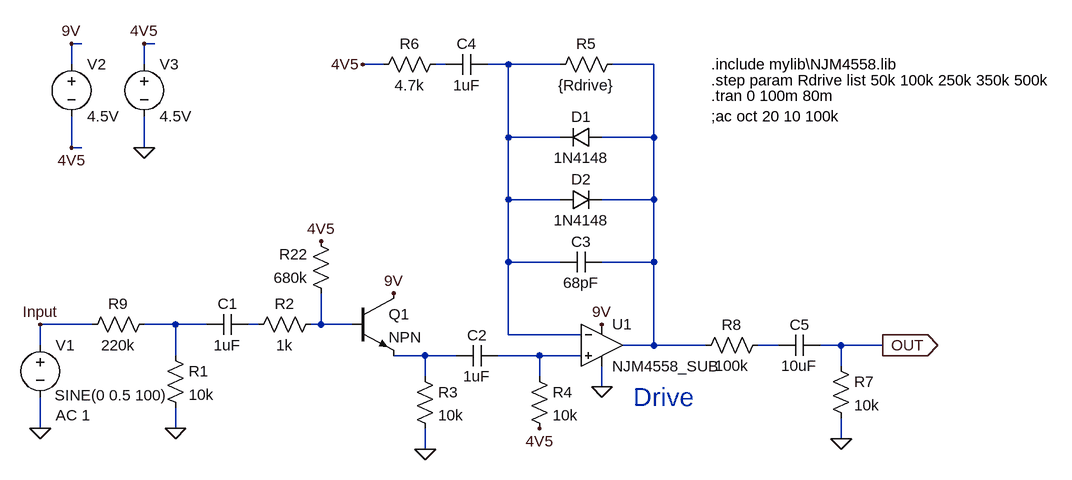
[diagram p0: schematic Tube_Screamer_Drive.asc]
Tube_Screamer_Drive.asc, the LTspice schematic file:
Version 4
SHEET 1 2708 1284
WIRE 176 -320 160 -320
WIRE 288 -320 272 -320
WIRE 160 -288 160 -320
WIRE 272 -288 272 -320
WIRE 640 -288 608 -288
WIRE 736 -288 720 -288
WIRE 832 -288 800 -288
WIRE 912 -288 832 -288
WIRE 1056 -288 992 -288
WIRE 832 -176 832 -288
WIRE 912 -176 832 -176
WIRE 1056 -176 1056 -288
WIRE 1056 -176 976 -176
WIRE 160 -160 160 -208
WIRE 176 -160 160 -160
WIRE 272 -160 272 -208
WIRE 832 -80 832 -176
WIRE 912 -80 832 -80
WIRE 1056 -80 1056 -176
WIRE 1056 -80 976 -80
WIRE 832 16 832 -80
WIRE 912 16 832 16
WIRE 1056 16 1056 -80
WIRE 1056 16 976 16
WIRE 192 112 112 112
WIRE 320 112 272 112
WIRE 368 112 320 112
WIRE 448 112 432 112
WIRE 544 112 544 64
WIRE 544 112 528 112
WIRE 592 112 544 112
WIRE 832 128 832 16
WIRE 944 128 832 128
WIRE 112 144 112 112
WIRE 1056 144 1056 16
WIRE 1056 144 1008 144
WIRE 1136 144 1056 144
WIRE 1248 144 1216 144
WIRE 1344 144 1312 144
WIRE 1408 144 1344 144
WIRE 320 160 320 112
WIRE 704 160 656 160
WIRE 752 160 704 160
WIRE 880 160 816 160
WIRE 944 160 880 160
WIRE 1344 176 1344 144
WIRE 704 192 704 160
WIRE 880 192 880 160
WIRE 976 208 976 176
WIRE 112 272 112 224
WIRE 320 272 320 240
WIRE 1344 288 1344 256
WIRE 704 304 704 272
FLAG 112 272 0
FLAG 320 272 0
FLAG 704 304 0
FLAG 976 208 0
FLAG 880 272 4V5
FLAG 656 64 9V
FLAG 976 112 9V
FLAG 544 -16 4V5
FLAG 112 112 Input
FLAG 608 -288 4V5
FLAG 1344 288 0
FLAG 1408 144 OUT
IOPIN 1408 144 Out
FLAG 160 -160 4V5
FLAG 272 -320 4V5
FLAG 272 -160 0
FLAG 160 -320 9V
SYMBOL voltage 112 128 R0
WINDOW 123 24 124 Left 2
WINDOW 39 0 0 Left 2
WINDOW 3 22 93 Left 2
SYMATTR Value2 AC 1
SYMATTR Value SINE(0 0.5 100)
SYMATTR InstName V1
SYMBOL res 304 144 R0
SYMATTR InstName R1
SYMATTR Value 10k
SYMBOL cap 432 96 R90
WINDOW 0 0 32 VBottom 2
WINDOW 3 32 32 VTop 2
SYMATTR InstName C1
SYMATTR Value 1uF
SYMBOL res 544 96 R90
WINDOW 0 0 56 VBottom 2
WINDOW 3 32 56 VTop 2
SYMATTR InstName R2
SYMATTR Value 1k
SYMBOL npn 592 64 R0
SYMATTR InstName Q1
SYMBOL res 688 176 R0
SYMATTR InstName R3
SYMATTR Value 10k
SYMBOL cap 816 144 R90
WINDOW 0 0 32 VBottom 2
WINDOW 3 32 32 VTop 2
SYMATTR InstName C2
SYMATTR Value 1uF
SYMBOL res 864 176 R0
SYMATTR InstName R4
SYMATTR Value 10k
SYMBOL Opamps\\opamp2 976 80 R0
SYMATTR InstName U1
SYMATTR Value NJM4558_SUB
SYMBOL cap 976 0 R90
WINDOW 0 0 32 VBottom 2
WINDOW 3 32 32 VTop 2
SYMATTR InstName C3
SYMATTR Value 68pF
SYMBOL diode 976 -160 M270
WINDOW 0 32 32 VTop 2
WINDOW 3 0 32 VBottom 2
SYMATTR InstName D1
SYMATTR Value 1N4148
SYMBOL diode 912 -64 R270
WINDOW 0 32 32 VTop 2
WINDOW 3 0 32 VBottom 2
SYMATTR InstName D2
SYMATTR Value 1N4148
SYMBOL res 1008 -304 R90
WINDOW 0 0 56 VBottom 2
WINDOW 3 32 56 VTop 2
SYMATTR InstName R5
SYMATTR Value {Rdrive}
SYMBOL cap 800 -304 R90
WINDOW 0 0 32 VBottom 2
WINDOW 3 32 32 VTop 2
SYMATTR InstName C4
SYMATTR Value 1uF
SYMBOL res 736 -304 R90
WINDOW 0 0 56 VBottom 2
WINDOW 3 32 56 VTop 2
SYMATTR InstName R6
SYMATTR Value 4.7k
SYMBOL res 560 80 R180
WINDOW 0 36 76 Left 2
WINDOW 3 36 40 Left 2
SYMATTR InstName R22
SYMATTR Value 680k
SYMBOL cap 1312 128 R90
WINDOW 0 0 32 VBottom 2
WINDOW 3 32 32 VTop 2
SYMATTR InstName C5
SYMATTR Value 10uF
SYMBOL res 1328 160 R0
SYMATTR InstName R7
SYMATTR Value 10k
SYMBOL res 1232 128 R90
WINDOW 0 0 56 VBottom 2
WINDOW 3 32 56 VTop 2
SYMATTR InstName R8
SYMATTR Value 100k
SYMBOL voltage 160 -304 R0
SYMATTR InstName V2
SYMATTR Value 4.5V
SYMBOL voltage 272 -304 R0
SYMATTR InstName V3
SYMATTR Value 4.5V
SYMBOL res 288 96 R90
WINDOW 0 0 56 VBottom 2
WINDOW 3 32 56 VTop 2
SYMATTR InstName R9
SYMATTR Value 220k
TEXT 1024 224 Left 4 ;Drive
TEXT 1144 -288 Left 2 !.include mylib\\NJM4558.lib
TEXT 1144 -264 Left 2 !.step param Rdrive list 50k 100k 250k 350k 500k
TEXT 1144 -240 Left 2 !.tran 0 100m 80m
TEXT 1144 -208 Left 2 !;ac oct 20 10 100k

The netlist it stands for:
* Tube_Screamer_Drive.asc
V1 Input 0 SINE(0 0.5 100) AC 1
R1 N004 0 10k
C1 N005 N004 1uF
R2 N006 N005 1k
Q1 9V N006 N008 0 NPN
R3 N008 0 10k
C2 N009 N008 1uF
R4 N009 4V5 10k
XU1 N009 N002 9V 0 N003 NJM4558_SUB  ; pins In+ In- V+ V- OUT
C3 N003 N002 68pF
D1 N003 N002 1N4148
D2 N002 N003 1N4148
R5 N003 N002 {Rdrive}
C4 N002 N001 1uF
R6 N001 4V5 4.7k
R22 N006 4V5 680k
C5 OUT N007 10uF
R7 OUT 0 10k
R8 N007 N003 100k
V2 9V 4V5 4.5V
V3 4V5 0 4.5V
R9 N004 Input 220k
.model D D
.lib standard.dio
.model NPN NPN
.model PNP PNP
.lib standard.bjt
* Drive
.include mylib\NJM4558.lib
.step param Rdrive list 50k 100k 250k 350k 500k
.tran 0 100m 80m
;ac oct 20 10 100k
.backanno
.end